# Altium schematic sheet TTL_TO_RS485.SchDoc
size A4
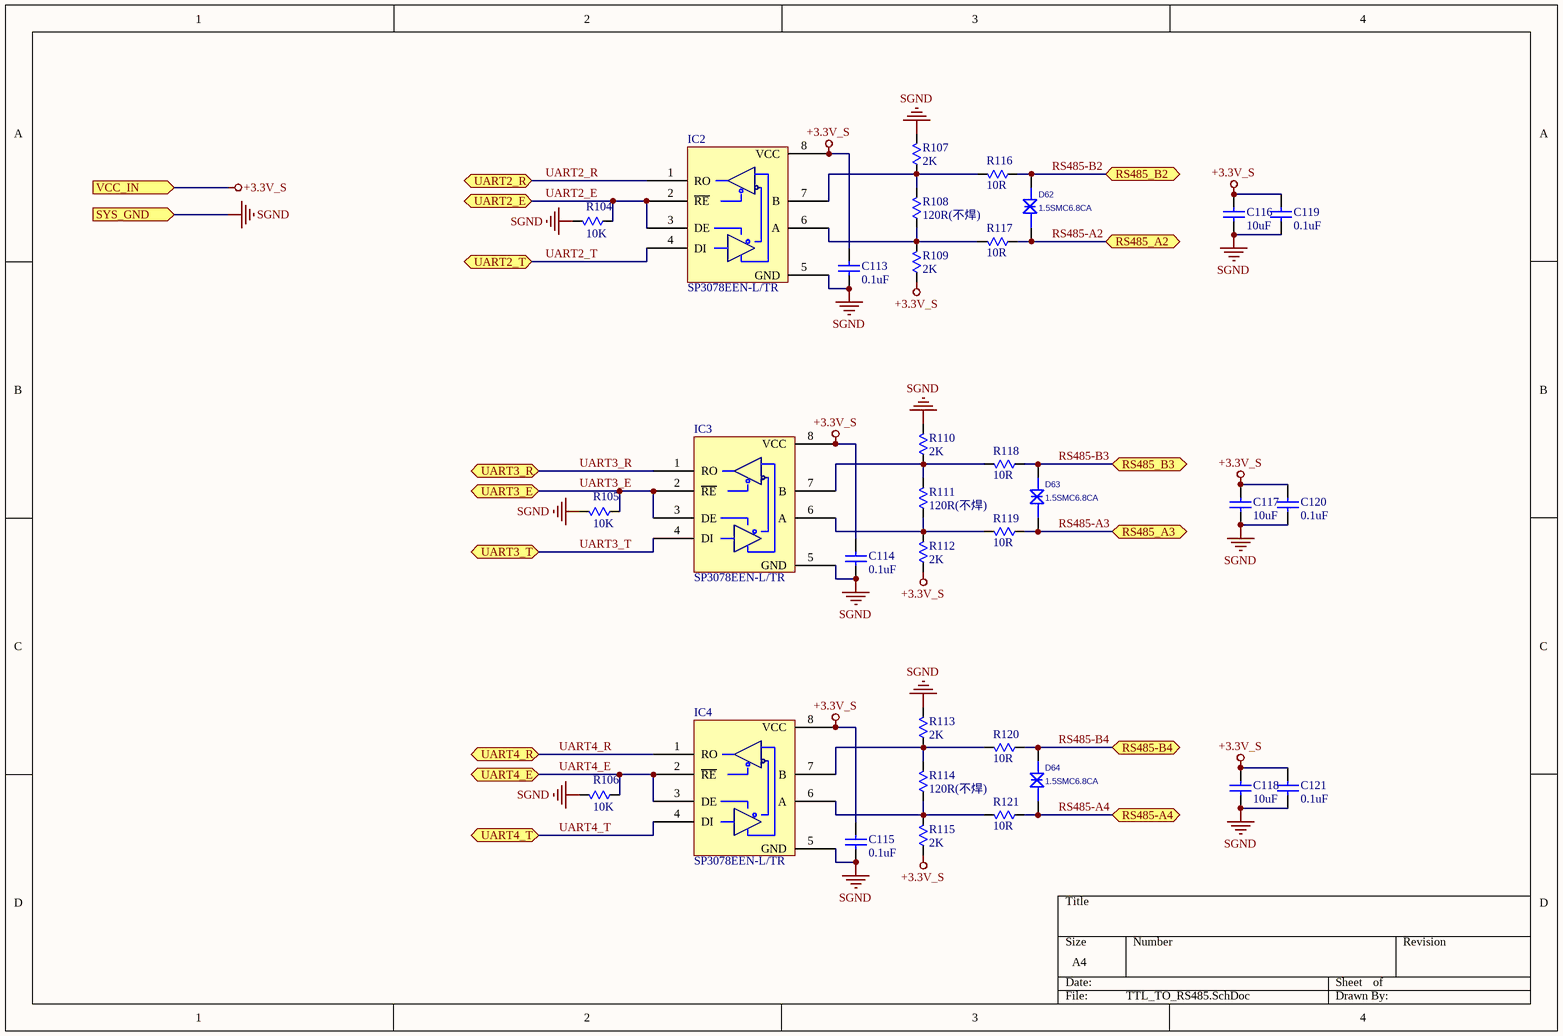
[diagram p0: TTL_TO_RS485.SchDoc]

## Parts
C113  0.1uF  [C0805]
C114  0.1uF  [C0805]
C115  0.1uF  [C0805]
C116  10uF  [C1206]
C117  10uF  [C1206]
C118  10uF  [C1206]
C119  0.1uF  [C1206]
C120  0.1uF  [C1206]
C121  0.1uF  [C1206]
D62  1.5SMC6.8CA  [SMC]
D63  1.5SMC6.8CA  [SMC]
D64  1.5SMC6.8CA  [SMC]
IC2  SP3078EEN-L/TR  [SO-8]
IC3  SP3078EEN-L/TR  [SO-8]
IC4  SP3078EEN-L/TR  [SO-8]
R104  10K  [R0805]
R105  10K  [R0805]
R106  10K  [R0805]
R107  2K  [R0805]
R108  120R(不焊)  [R0805]
R109  2K  [R0805]
R110  2K  [R0805]
R111  120R(不焊)  [R0805]
R112  2K  [R0805]
R113  2K  [R0805]
R114  120R(不焊)  [R0805]
R115  2K  [R0805]
R116  10R  [R0805]
R117  10R  [R0805]
R118  10R  [R0805]
R119  10R  [R0805]
R120  10R  [R0805]
R121  10R  [R0805]

## Ports
RS485-A4 (bidir), RS485-B4 (bidir), RS485_A2 (bidir), RS485_A3 (bidir), RS485_B2 (bidir), RS485_B3 (bidir), SYS_GND (in), UART2_E (bidir), UART2_R (bidir), UART2_T (bidir), UART3_E (bidir), UART3_R (bidir), UART3_T (bidir), UART4_E (bidir), UART4_R (bidir), UART4_T (bidir), VCC_IN (in)

## Nets
+3.3V_S: C113.2 C114.2 C115.2 C116.2 C117.2 C118.2 C119.2 C120.2 C121.2 IC2.8(VCC) IC3.8(VCC) IC4.8(VCC) R109.1 R112.1 R115.1 ; port VCC_IN
SGND: C113.1 C114.1 C115.1 C116.1 C117.1 C118.1 C119.1 C120.1 C121.1 IC2.5(GND) IC3.5(GND) IC4.5(GND) R104.2 R105.2 R106.2 R107.2 R110.2 R113.2 ; port SYS_GND
RS485-A2: D62.2 R117.1 ; port RS485_A2
RS485-A3: D63.2 R119.1 ; port RS485_A3
RS485-A4: D64.2 R121.1 ; port RS485-A4
RS485-B2: D62.1 R116.1 ; port RS485_B2
RS485-B3: D63.1 R118.1 ; port RS485_B3
RS485-B4: D64.1 R120.1 ; port RS485-B4
UART2_E: IC2.2(~{RE}) IC2.3(DE) R104.1 ; port UART2_E
UART2_R: IC2.1(RO) ; port UART2_R
UART2_T: IC2.4(DI) ; port UART2_T
UART3_E: IC3.2(~{RE}) IC3.3(DE) R105.1 ; port UART3_E
UART3_R: IC3.1(RO) ; port UART3_R
UART3_T: IC3.4(DI) ; port UART3_T
UART4_E: IC4.2(~{RE}) IC4.3(DE) R106.1 ; port UART4_E
UART4_R: IC4.1(RO) ; port UART4_R
UART4_T: IC4.4(DI) ; port UART4_T
NetIC2_6: IC2.6(A) R108.1 R109.2 R117.2
NetIC2_7: IC2.7(B) R107.1 R108.2 R116.2
NetIC3_6: IC3.6(A) R111.1 R112.2 R119.2
NetIC3_7: IC3.7(B) R110.1 R111.2 R118.2
NetIC4_6: IC4.6(A) R114.1 R115.2 R121.2
NetIC4_7: IC4.7(B) R113.1 R114.2 R120.2

## Library data of the parts
C113-C121 = CAP: Published: 8-Jun-2000; LatestRevisionDate: 17-Jul-2002; LatestRevisionNote: Re-released for DXP Platform.; PackageReference: RAD-0.3; Publisher: Altium Limited
  C113-C115 C119-C121: Value: 0.1uF
  C116-C118: Value: 10uF
D62-D64 = P0080_1: Part Descriptions: Polymar ESD; Manufacturer: SemiTel; Part Type: ESD
IC2-IC4 = SP3078EEN
R104-R121 = RES: Resistor; Published: 8-Jun-2000; LatestRevisionDate: 17-Jul-2002; LatestRevisionNote: Re-released for DXP Platform.; PackageReference: AXIAL-0.3; Publisher: Altium Limited
  R104-R106: Value: 10K
  R107 R109 R110 R112 R113 R115: Value: 2K
  R108 R111 R114: Value: 120R(不焊)
  R116-R121: Value: 10R